# EAGLE design aquaMain (EAGLE 6.6.0)
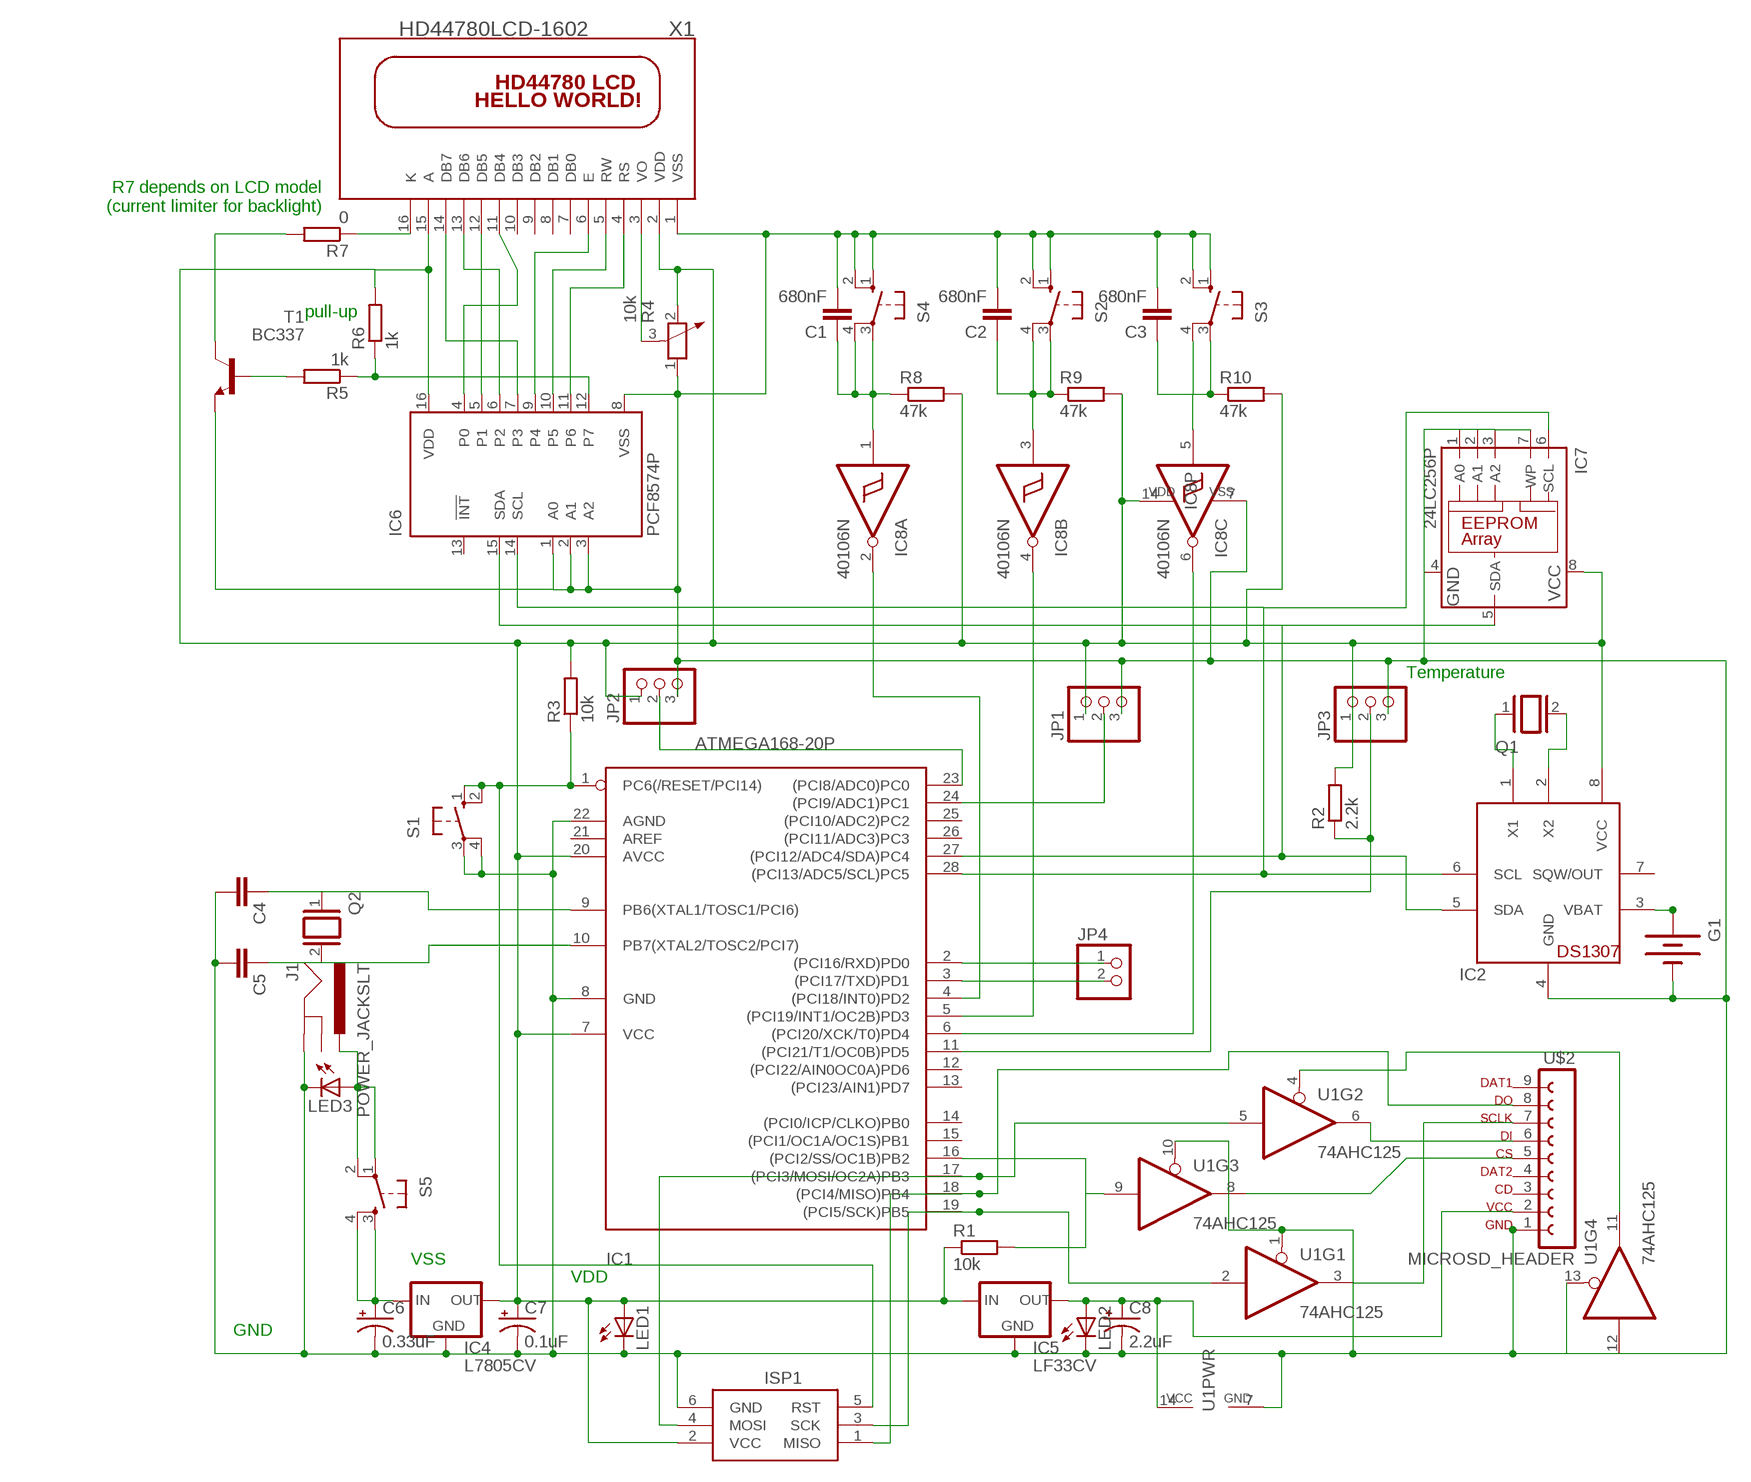
[diagram p0: schematic, sheet 1]

## Parts
C1  680nF  C-EU050-050X075  [C050-050X075]
C2  680nF  C-EU050-050X075  [C050-050X075]
C3  680nF  C-EU050-050X075  [C050-050X075]
C4  C-EU025-024X044  [C025-024X044]
C5  C-EU025-024X044  [C025-024X044]
C6  0.33uF  CPOL-USE5-6  [E5-6]
C7  0.1uF  CPOL-USE5-6  [E5-6]
C8  2.2uF  CPOL-USE5-6  [E5-6]
G1  BATTERY20PTH  [BATTCOM_20MM_PTH]
IC1  ATMEGA168-20P  [DIL28-3]
IC2  DS1307  [DIL08]
IC4  L7805CV  [TO220]
IC5  LF33CV  [TO220]
IC6  PCF8574P  [DIL16]
IC7  24LC256P  [DIL8]
IC8  40106N  [DIL14]
ISP1  AVRISP-6  [AVRISP]
J1  POWER_JACKSLT  [POWER_JACK_SLOT]
JP1  PINHD-1X3  [1X03]
JP2  PINHD-1X3  [1X03]
JP3  PINHD-1X3  [1X03]
JP4  PINHD-1X2  [1X02]
LED1  LED3MM  [LED3MM]
LED2  LED3MM  [LED3MM]
LED3  LED3MM  [LED3MM]
Q1  XTAL/S  [QS]
Q2  XTAL/S  [QS]
R1  10k  R-EU_0204/7  [0204/7]
R2  2.2k  R-EU_0204/7  [0204/7]
R3  10k  R-EU_0204/7  [0204/7]
R4  10k  POTENTIOMETER_PT-10  [PT-10]
R5  1k  R-EU_0204/5  [0204/5]
R6  1k  R-EU_0204/5  [0204/5]
R7  0  R-EU_0204/5  [0204/5]
R8  47k  R-EU_0204/5  [0204/5]
R9  47k  R-EU_0204/5  [0204/5]
R10  47k  R-EU_0204/5  [0204/5]
S1  40-XX-ROUND  [B3F-40XX-ROUND]
S2  40-XX-ROUND  [B3F-40XX-ROUND]
S3  40-XX-ROUND  [B3F-40XX-ROUND]
S4  40-XX-ROUND  [B3F-40XX-ROUND]
S5  TAC_SWITCHPTH  [TACTILE-PTH]
T1  BC337  [TO92]
U1  74AHC125  [DIP14]
U$2  MICROSD_HEADER  [9PINH]
X1  HD44780LCD-1602  [LCD1602]

## Nets
N$2: IC1.23((PCI8/ADC0)PC0) JP2.2
N$3: IC1.5((PCI19/INT1/OC2B)PD3) IC8.4(B:O)
N$4: IC2.1(X1) Q1.1
N$5: IC2.2(X2) Q1.2
N$6: G1.1(+) IC2.3(VBAT)
N$7: IC1.11((PCI21/T1/OC0B)PD5) JP3.2 R2.1
N$8: IC1.28((PCI13/ADC5/SCL)PC5) IC2.6(SCL) IC6.14(SCL) IC7.6(SCL)
N$9: IC1.4((PCI18/INT0)PD2) IC8.2(A:O)
N$10: IC1.6((PCI20/XCK/T0)PD4) IC8.6(C:O)
N$11: C4.1 IC1.9(PB6(XTAL1/TOSC1/PCI6)) Q2.1
N$12: C5.1 IC1.10(PB7(XTAL2/TOSC2/PCI7)) Q2.2
N$13: IC1.18((PCI4/MISO)PB4) ISP1.1(MISO) U$2.8
N$14: IC1.17((PCI3/MOSI/OC2A)PB3) ISP1.4(MOSI) U1.5(I)
N$15: IC1.16((PCI2/SS/OC1B)PB2) R1.2 U1.9(I)
N$16: IC1.19((PCI5/SCK)PB5) ISP1.3(SCK) U1.2(I)
N$17: U1.3(O) U$2.7
N$18: U1.8(O) U$2.5
N$19: U1.6(O) U$2.6
N$20: IC1.1(PC6(/RESET/PCI14)) ISP1.5(RST) R3.1 S1.1(S) S1.2(S1)
N$21: IC1.27((PCI12/ADC4/SDA)PC4) IC2.5(SDA) IC6.15(SDA) IC7.5(SDA)
N$22: C8.+ IC5.VOUT(OUT) LED2.A U1.14(PWR:VCC) U$2.2
N$23: R4.3 X1.3(VO)
N$24: IC1.24((PCI9/ADC1)PC1) JP1.2
N$25: C7.+ IC1.7(VCC) IC1.20(AVCC) IC2.8(VCC) IC4.VOUT(OUT) IC5.VIN(IN) IC6.16(VDD) IC7.8(VCC) IC8.14(P:VDD) ISP1.2(VCC) JP1.1 JP2.1 JP3.1 LED1.A R1.1 R2.2 R3.2 R4.2 R6.2 R8.2 R9.2 R10.2 X1.2(VDD) X1.15(A)
N$31: J1.PWR LED3.A S5.1 S5.2
N$32: IC6.4(P0) X1.11(DB4)
N$33: IC6.5(P1) X1.12(DB5)
N$34: IC6.6(P2) X1.13(DB6)
N$35: IC6.7(P3) X1.14(DB7)
N$36: IC6.9(P4) X1.6(E)
N$37: IC6.10(P5) X1.5(RW)
N$38: IC6.11(P6) X1.4(RS)
N$39: IC6.12(P7) R5.1 R6.1
N$40: R5.2 T1.2(B)
N$41: R7.1 X1.16(K)
N$42: R7.2 T1.3(C)
N$43: C1.1 IC8.1(A:I) R8.1 S4.3(P) S4.4(P1)
N$44: C2.1 IC8.3(B:I) R9.1 S2.3(P) S2.4(P1)
N$45: C3.1 IC8.5(C:I) R10.1 S3.3(P) S3.4(P1)
N$46: C6.+ IC4.VIN(IN) S5.3 S5.4
N$56: IC1.2((PCI16/RXD)PD0) JP4.1
N$57: IC1.3((PCI17/TXD)PD1) JP4.2
N$58: U1.4(OE) U1.11(O)
VSS: C1.2 C2.2 C3.2 C4.2 C5.2 C6.- C7.- C8.- G1.2(-) IC1.8(GND) IC1.22(AGND) IC2.4(GND) IC4.GND IC5.GND IC6.1(A0) IC6.2(A1) IC6.3(A2) IC6.8(VSS) IC7.1(A0) IC7.2(A1) IC7.3(A2) IC7.4(GND) IC7.7(WP) IC8.7(P:VSS) ISP1.6(GND) J1.GND@2(GND) JP1.3 JP2.3 JP3.3 LED1.K(C) LED2.K(C) LED3.K(C) R4.1 S1.3(P) S1.4(P1) S2.1(S) S2.2(S1) S3.1(S) S3.2(S1) S4.1(S) S4.2(S1) T1.1(E) U1.1(OE) U1.7(PWR:GND) U1.10(OE) U1.12(I) U1.13(OE) U$2.1 X1.1(VSS)
Unconnected: IC1.12((PCI22/AIN0OC0A)PD6) IC1.13((PCI23/AIN1)PD7) IC1.14((PCI0/ICP/CLKO)PB0) IC1.15((PCI1/OC1A/OC1S)PB1) IC1.21(AREF) IC1.25((PCI10/ADC2)PC2) IC1.26((PCI11/ADC3)PC3) IC2.7(SQW/OUT) IC6.13(!INT) IC8.8(D:O) IC8.9(D:I) IC8.10(E:O) IC8.11(E:I) IC8.12(F:O) IC8.13(F:I) J1.GND@1(GNDBREAK) U$2.3 U$2.4 U$2.9 X1.7(DB0) X1.8(DB1) X1.9(DB2) X1.10(DB3)

## Notes on the sheet
- R7 depends on LCD model
  (current limiter for backlight)
- pull-up
- Temperature
- VSS
- VDD
- GND

## Library data of the parts
C1-C5 = rcl:C-EU: CAPACITOR, European symbol
C6-C8 = rcl:CPOL-US: POLARIZED CAPACITOR, American symbol
G1 = SparkFun-Electromechanical:BATTERY: Battery Holders Various common sizes : AA, AAA, 20mm coin cell and 12mm coin cell. 20MM_4LEGS, BATT-10373
IC1 = adafruit:ATMEGA168*P: MICROCONTROLLER 16 kBytes FLASH 1 kBytes SRAM 512 Bytes EEPROM USART 8-channel 10 bit ADC
IC2 = adafruit:DS1307: DS1307 Real time clock (RTC) with battery backup ability. Talk to it via i2c
IC4 = dedicatedLib:L7805CV: L7805CV Positive voltage regulator 5V 0.5A From http://datasheet.octopart.com/L7805CV-STMicroelectronics-datasheet-7264666.pdf
IC5 = dedicatedLib:LF33CV: LF33CV Low-drop voltage regulator 3.3V 0.5A From http://www.farnell.com/datasheets/1599547.pdf
IC6 = micro-philips:PCF8574: I2C-Bus Remote 8-bit I/O expander http://www.semiconductors.philips.com/acrobat_download/datasheets/PCF8574_4.pdf; MPN: PCF8574PN; OC_FARNELL: 204020; OC_NEWARK: 11N8515
IC7 = microchip:24*: Serial EEPROM I2C; MF: MICROCHIP; MPN: 24LC256-E/P; OC_FARNELL: 9757970; OC_NEWARK: 92C7169
IC8 = 40xx:40106: Hex SCHMITT TRIGGER
ISP1 = adafruit:AVRISP: AVR ISP HEADER Standard 6 pin header for AVR programming
J1 = SparkFun-Connectors:POWER_JACK: Power Jack This is the standard 5.5mm barrel jack for power. The PTH is the most common, proven, reliable, footprint. The Slot footprint only works if the mill layer is transmitted to the PCB fab house so be warned. Mating wall wart : TOL-00298 (and others); PROD_ID: PRT-00119
JP1-JP3 = adafruit:PINHD-1X3: PIN HEADER
JP4 = pinhead:PINHD-1X2: PIN HEADER
LED1-LED3 = SparkFun-LED:LED: LEDs Standard schematic elements and footprints for 5mm, 3mm, 1206, and 0603 sized LEDs. 5mm - Spark Fun Electronics SKU : COM-00529 (and others)
Q1 Q2 = special:XTAL/S: CRYSTAL
R1-R3 R5-R10 = rcl:R-EU_: RESISTOR, European symbol
R4 = rcl:POTENTIOMETER_: Potentiometer
S1-S4 = adafruit:40-XX: OMRON SWITCH
S5 = SparkFun-Electromechanical:TAC_SWITCH: Momentary Switch Button commonly used for reset or general input. Spark Fun Electronics SKU : COM-00097 SMT- SWCH-08247
T1 = transistor:BC337: NPN TRANSISTOR
U1 = dedicatedLib:74AHC125: The 74AHC125 74AHCT125 provides four non-inverting buffer/line drivers with 3-state outputs. The 3-state outputs (nY) are controlled by the output enable input (nOE). A HIGH at nOE causes the outputs to assume a high-impedance OFF-state.
U$2 = dedicatedLib:MICROSD_HEADER
X1 = adafruit:HD44780LCD: HD44780 LCD Standard character type LCDs, available in sizes from 8x1 to 40x4!

## Board
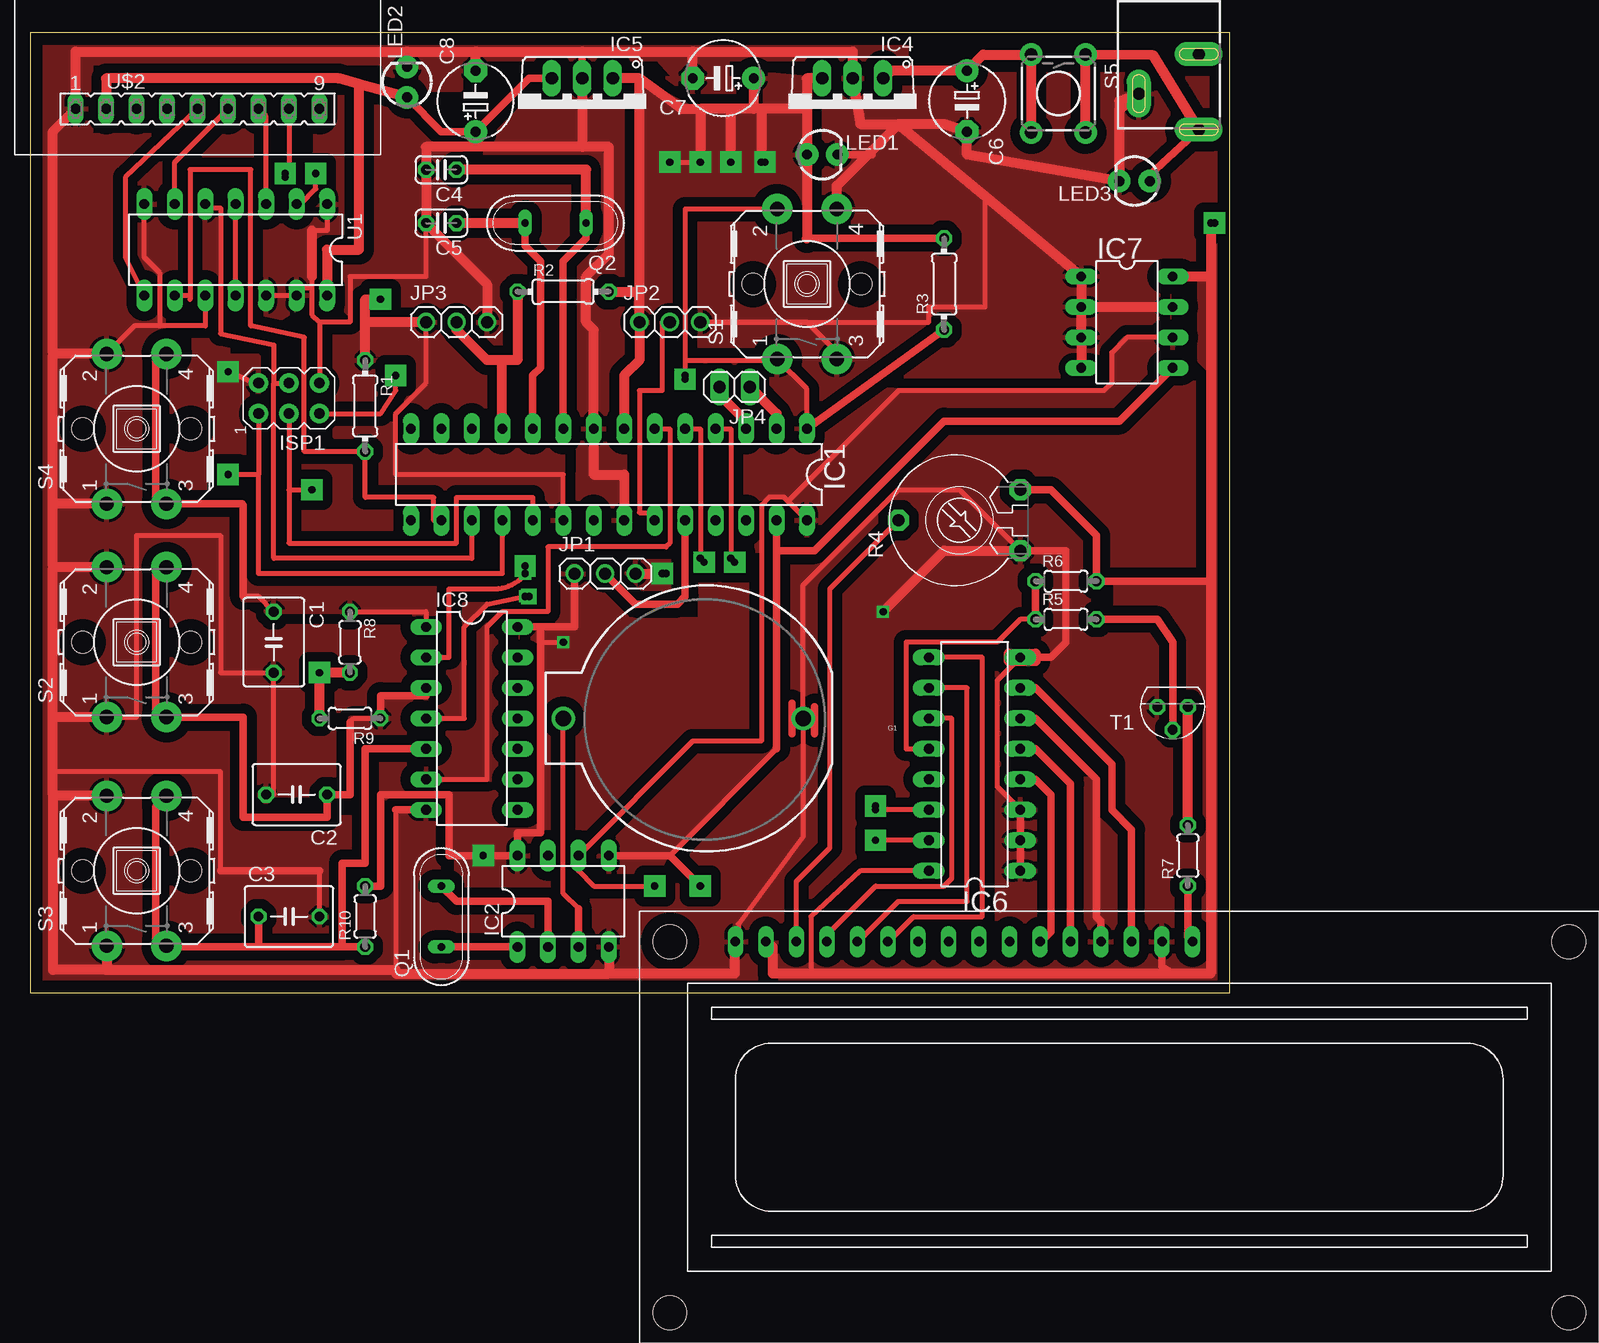
[diagram p1: board, top side]
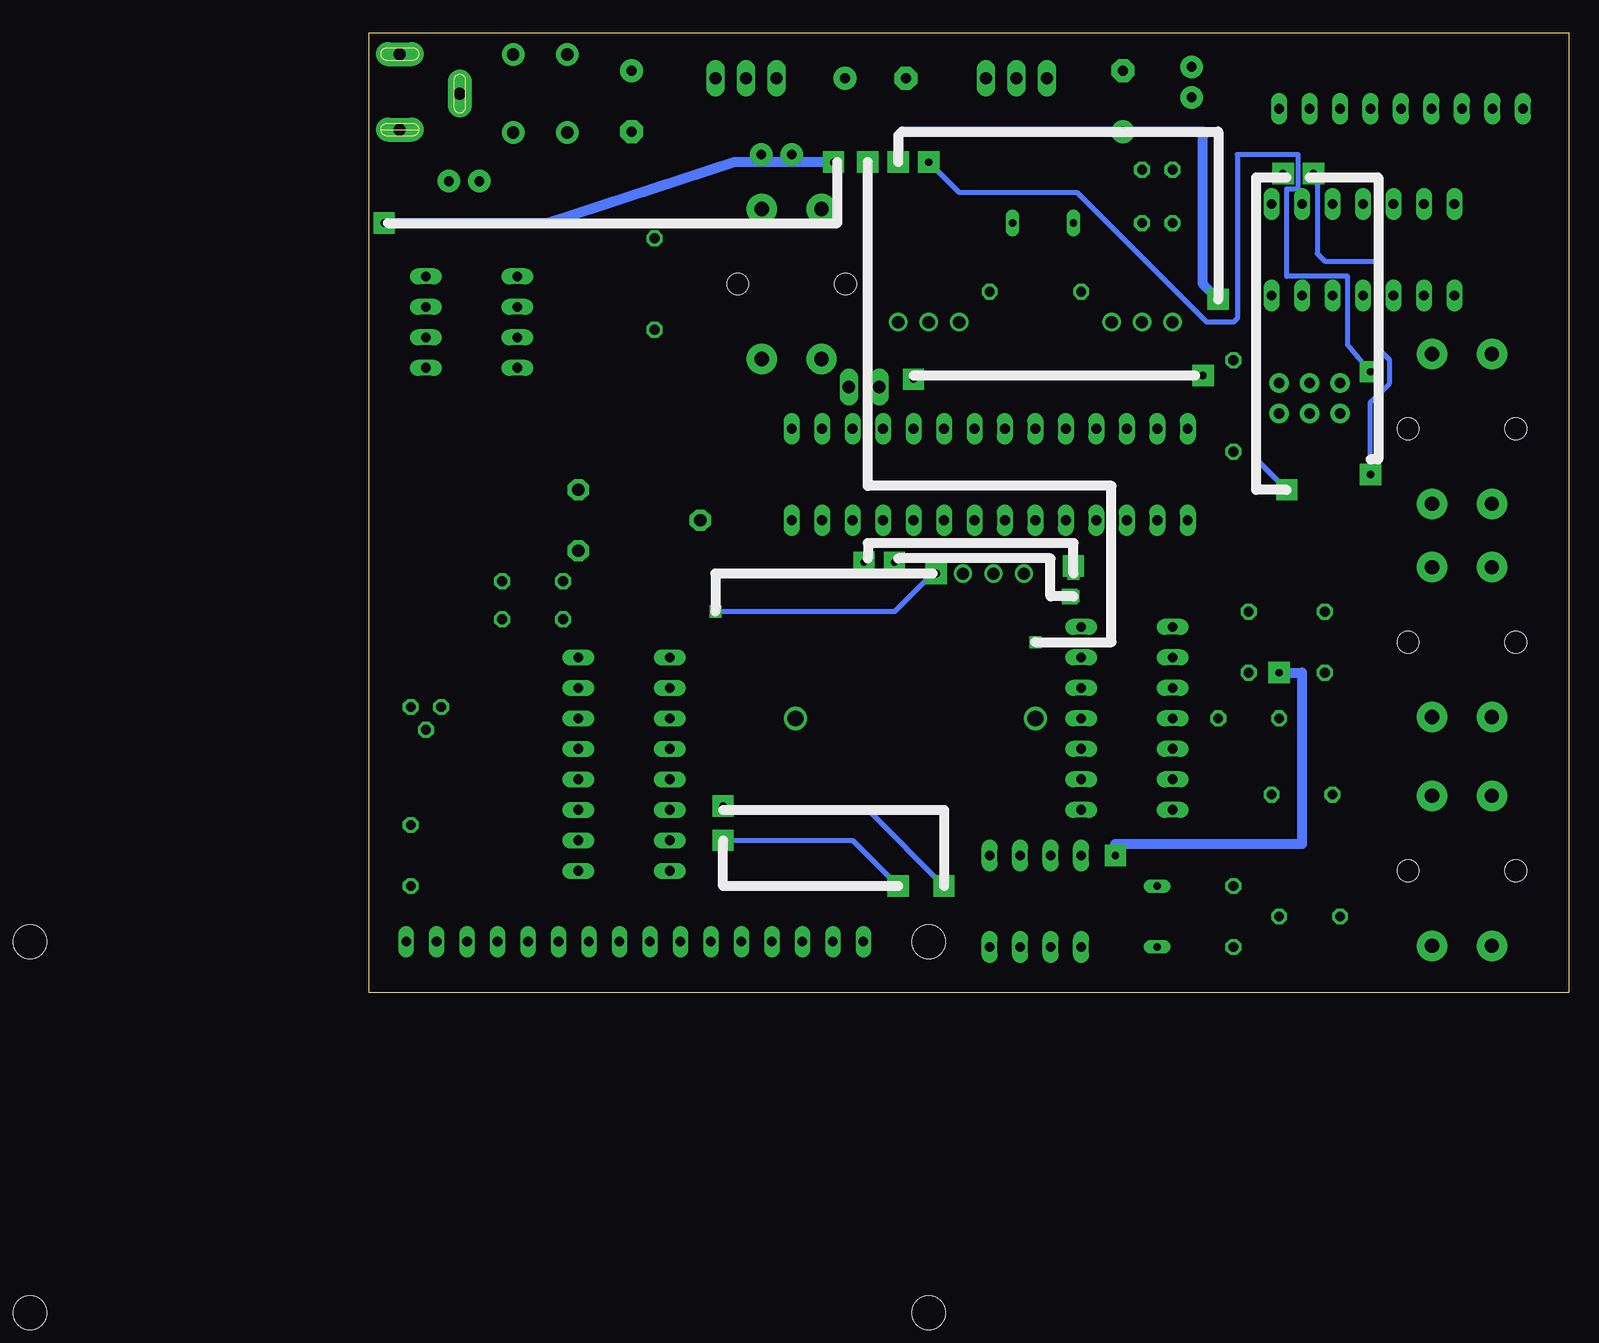
[diagram p2: board, bottom side, seen from below]

Size 100 x 80 mm. Coordinates in mm from the lower left corner, seen from the top.
Outline: 0,0 100,0 100,80 0,80 0,0
Copper layers (1*16): Top 0.035mm / dielectric 1.5mm / Bottom 0.035mm
Design rules "default": minimum track width 10mil, minimum drill 24mil, track to track 8mil, track to pad 8mil, pad to pad 8mil, via to via 8mil, smd to smd 8mil, copper to edge 40mil, drill to drill 8mil, minimum pad ring 10mil, minimum via ring 8mil, stop-mask expansion 4mil, vias tented up to drill 0mil, thermal gap 10mil

### Footprints (pad centres in the part's own frame; a part is rotated, then mirrored left to right if it is on the bottom)
C050-050X075 = drill 0.813 octagon: 1 -2.54,0; 2 2.54,0
C025-024X044 = drill 0.813 octagon: 1 -1.27,0; 2 1.27,0
E5-6 = drill 0.813 pad 1.905: + -2.54,0 | drill 0.813 pad 1.905 octagon: - 2.54,0
BATTCOM_20MM_PTH = drill 1.3: 1 11.85,0; 2 -8.15,0
DIL28-3 = drill 0.813 long: 1 -16.51,-3.81; 2 -13.97,-3.81; 3 -11.43,-3.81; 4 -8.89,-3.81; 5 -6.35,-3.81; 6 -3.81,-3.81; 7 -1.27,-3.81; 8 1.27,-3.81; 9 3.81,-3.81; 10 6.35,-3.81; 11 8.89,-3.81; 12 11.43,-3.81; 13 13.97,-3.81; 14 16.51,-3.81; 15 16.51,3.81; 16 13.97,3.81; 17 11.43,3.81; 18 8.89,3.81; 19 6.35,3.81; 20 3.81,3.81; 21 1.27,3.81; 22 -1.27,3.81; 23 -3.81,3.81; 24 -6.35,3.81; 25 -8.89,3.81; 26 -11.43,3.81; 27 -13.97,3.81; 28 -16.51,3.81
DIL08 = drill 0.813 long: 1 -3.81,-3.81; 2 -1.27,-3.81; 3 1.27,-3.81; 4 3.81,-3.81; 5 3.81,3.81; 6 1.27,3.81; 7 -1.27,3.81; 8 -3.81,3.81
TO220 = drill 1.016 long: GND 0,0; VIN -2.54,0; VOUT 2.54,0
DIL16 = drill 0.813 long: 1 -8.89,-3.81; 2 -6.35,-3.81; 3 -3.81,-3.81; 4 -1.27,-3.81; 5 1.27,-3.81; 6 3.81,-3.81; 7 6.35,-3.81; 8 8.89,-3.81; 9 8.89,3.81; 10 6.35,3.81; 11 3.81,3.81; 12 1.27,3.81; 13 -1.27,3.81; 14 -3.81,3.81; 15 -6.35,3.81; 16 -8.89,3.81
DIL8 = drill 0.813 long: 1 -3.81,-3.81; 2 -1.27,-3.81; 3 1.27,-3.81; 4 3.81,-3.81; 5 3.81,3.81; 6 1.27,3.81; 7 -1.27,3.81; 8 -3.81,3.81
DIL14 = drill 0.813 long: 1 -7.62,-3.81; 2 -5.08,-3.81; 3 -2.54,-3.81; 4 0,-3.81; 5 2.54,-3.81; 6 5.08,-3.81; 7 7.62,-3.81; 8 7.62,3.81; 9 5.08,3.81; 10 2.54,3.81; 11 0,3.81; 12 -2.54,3.81; 13 -5.08,3.81; 14 -7.62,3.81
AVRISP = drill 0.9 pad 1.626: 1 -1.27,2.54; 2 1.27,2.54; 3 -1.27,0; 4 1.27,0; 5 -1.27,-2.54; 6 1.27,-2.54
POWER_JACK_SLOT = drill 1 pad 2 long: GND@1 2.58,7.5; GND@2 7.58,10.8; PWR 2.58,13.8
1X03 = drill 1.016: 1 -2.54,0; 2 0,0; 3 2.54,0
1X02 = drill 1.016 long: 1 -1.27,0; 2 1.27,0
LED3MM = drill 0.813 pad 1.88: A -1.27,0; K 1.27,0
QS = drill 0.61 long: 1 -2.54,0; 2 2.54,0
0204/7 = drill 0.813 octagon: 1 -3.81,0; 2 3.81,0
PT-10 = drill 1.016 pad 1.778 octagon: 1 -2.54,-5.08; 2 2.54,-5.08; 3 0,5.08
0204/5 = drill 0.813 octagon: 1 -2.54,0; 2 2.54,0
B3F-40XX-ROUND = drill 1.194 pad 2.54: 1 -6.248,2.489; 2 6.248,2.489; 3 -6.248,-2.489; 4 6.248,-2.489 | hole 1.803: 0,-4.496; 0,4.496
TACTILE-PTH = drill 1.016 pad 1.88: 1 -3.251,2.261; 2 3.251,2.261; 3 -3.251,-2.261; 4 3.251,-2.261
TO92 = drill 0.813 octagon: 1 1.27,0; 2 0,1.905; 3 -1.27,0
DIP14 = drill 0.813 long: 1 -7.62,-3.81; 2 -5.08,-3.81; 3 -2.54,-3.81; 4 0,-3.81; 5 2.54,-3.81; 6 5.08,-3.81; 7 7.62,-3.81; 8 7.62,3.81; 9 5.08,3.81; 10 2.54,3.81; 11 0,3.81; 12 -2.54,3.81; 13 -5.08,3.81; 14 -7.62,3.81
9PINH = drill 0.813 long: 1 -10.16,0; 2 -7.62,0; 3 -5.08,0; 4 -2.54,0; 5 0,0; 6 2.54,0; 7 5.08,0; 8 7.62,0; 9 10.16,0
LCD1602 = drill 0.8 long: 1 8,33.46; 2 10.54,33.46; 3 13.08,33.46; 4 15.62,33.46; 5 18.16,33.46; 6 20.7,33.46; 7 23.24,33.46; 8 25.78,33.46; 9 28.32,33.46; 10 30.86,33.46; 11 33.4,33.46; 12 35.94,33.46; 13 38.48,33.46; 14 41.02,33.46; 15 43.56,33.46; 16 46.1,33.46 | hole 2.8: 2.54,2.54; 2.54,33.46; 77.46,33.46; 77.46,2.54

### Placement (x,y rotation side)
C1  20.32,29.21 270 top
C2  22.23,16.51 180 top
C3  21.59,6.35 0 top
C4  34.29,68.58 180 top
C5  34.29,64.14 180 top
C6  78.11,74.3 270 top
C7  57.78,76.2 180 top
C8  37.15,74.3 90 top
G1  56.3,22.86 180 top
IC1  48.26,43.18 180 top
IC2  44.45,7.62 0 top
IC4  68.58,76.2 180 top
IC5  46.04,76.2 180 top
IC6  78.74,19.05 90 top
IC7  91.44,55.88 270 top
IC8  36.83,22.86 270 top
ISP1  21.59,49.53 90 top
J1  100.01,85.72 180 top
JP1  47.94,34.92 0 top
JP2  53.34,55.88 0 top
JP3  35.56,55.88 0 top
JP4  58.74,50.48 180 top
LED1  66.04,69.85 0 top
LED2  31.43,75.88 90 top
LED3  92.08,67.63 180 top
Q1  34.29,6.35 90 top
Q2  43.81,64.14 180 top
R1  27.94,48.9 270 top
R2  44.45,58.42 0 top
R3  76.2,59.05 90 top
R4  77.47,39.37 90 top
R5  86.36,31.11 0 top
R6  86.36,34.29 0 top
R7  96.52,11.43 90 top
R8  26.67,29.21 270 top
R9  26.67,22.86 180 top
R10  27.94,6.35 90 top
S1  64.77,59.05 90 top
S2  8.89,29.21 90 top
S3  8.89,10.16 90 top
S4  8.89,46.99 90 top
S5  85.72,74.93 270 top
T1  95.25,23.81 180 top
U1  17.14,61.91 180 top
U$2  13.97,73.66 0 top
X1  50.8,-29.21 0 top

### Tracks (layer width: path | path; a pad name or v marks a point on that pad's centre or on a via)
N$1
  pour Top (isolate 0.813): 92.08,78.11 97.79,78.11 98.11,77.79 98.11,71.44 96.2,71.44 96.2,73.66
N$2
  Top 0.406: JP2.2 52.7,55.88 52.7,50.16 50.8,50.16 50.8,40.01 52.07,40.01 IC1.23
N$3  (via drill 0.6, 0.6 pad 1.27)
  Top 0.406: IC8.4 36.2,22.86 36.2,30.48 38.1,32.38 v41.27,33.02 | IC1.5 55.88,46.99 v55.88,36.2
  Bottom 0.406: v55.88,36.2 43.18,36.2 43.18,33.02 v41.59,33.02 v41.27,33.02
  pour Top (isolate 0.813): 35.88,22.86 33.97,22.86 33.97,27.62 36.2,27.62
  pour Top (isolate 0.813): 38.1,32.38 36.2,30.48 36.2,32.38 37.78,32.38
N$4
  Top 0.61: IC2.1 Q1.1
N$5
  Top 0.61: IC2.2 43.18,7.62 35.56,7.62 Q1.2
N$6
  Top 0.406: 45.72,6.99 44.45,8.26 G1.1
  Top 0.61: IC2.3 45.72,6.99
N$7
  Top 0.813: R2.1 40.64,52.7 39.37,52.7 | 39.37,52.7 38.1,52.7 35.56,55.24 JP3.2 | IC1.11 39.37,52.7
N$8  (via drill 0.6, 0.6 pad 1.78)
  Top 0.406: v52.07,8.89 46.99,8.89 45.72,10.16 IC2.6 55.24,20.95 60.96,20.95 60.96,40.64 61.59,41.27 62.87,41.27 63.18,40.96 | IC6.14 v70.48,15.24 | IC1.28 63.18,40.96 | IC7.6 91.44,54.61 90.17,53.34 90.17,50.8 89.53,50.16 72.39,50.16 63.18,40.96
  Bottom 0.406: v70.48,15.24 58.42,15.24 v52.07,8.89
  pour Top (isolate 0.813): 95.25,54.61 95.25,51.75 90.81,47.62 76.2,47.62 65.09,36.83 62.23,36.83 58.42,36.83 58.42,46.99 64.77,46.99 69.85,50.48 72.71,50.16 89.53,50.16 90.17,50.8 90.17,53.34 91.44,54.61
N$9  (via drill 0.6, 0.6 pad 1.78)
  Top 0.406: IC8.2 34.92,27.94 34.92,33.66 38.73,33.66 arc53 v41.27,34.92 | IC1.4 58.42,46.99 v58.42,36.2
  Bottom 0.406: v58.42,36.2 58.42,37.47 41.27,37.47 v41.27,35.56 v41.27,34.92
N$10
  Top 0.406: IC8.6 38.1,17.78 38.1,30.48 39.37,31.75 43.18,31.75 43.18,37.15 53.02,37.15 53.34,37.47 53.34,46.99 IC1.6
  pour Top (isolate 0.813): 38.1,29.21 38.1,30.8 36.51,30.8 36.2,30.48 36.2,23.18 35.88,22.86 33.02,22.86 33.02,17.78 32.7,17.46 36.83,18.1 38.1,17.78 39.69,17.78 39.69,31.43
N$11
  Top 0.61: Q2.1 46.35,62.87 44.45,60.96 IC1.9
  Top 0.813: Q2.1 46.35,68.58 C4.1
N$12
  Top 0.61: Q2.2 41.27,62.23 42.55,60.96 42.55,52.07 41.91,51.44 IC1.10
  Top 0.813: Q2.2 C5.1
N$13  (via drill 0.6, 0.6 pad 1.78)
  Top 0.406: IC1.18 39.37,34.92 19.05,34.92 19.05,43.18 | v21.27,67.94 v21.27,68.26 21.59,68.26 U$2.8 | ISP1.1 19.05,43.18 | 19.05,43.18 v16.51,43.18
  Bottom 0.406: v16.51,43.18 16.51,49.21 14.92,50.8 14.92,52.7 15.88,53.66 15.88,60.96 20.32,60.96 20.95,61.59 20.95,67.31 v21.27,67.94
N$14
  Top 0.406: IC1.17 36.83,36.2 20.32,36.2 20.32,50.8 | 20.32,50.8 ISP1.4 | 20.32,50.8 20.32,53.98 15.88,54.93 15.88,65.41 14.61,65.41 U1.5
  pour Top (isolate 0.813): 14.61,65.41 18.41,65.41 18.41,57.47 13.34,57.47 13.34,65.41
N$15
  Top 0.406: IC1.16 33.66,39.37 33.66,41.27 27.94,41.27 R1.2 22.86,45.09 22.86,54.61 18.41,55.56 18.41,68.58 13.34,68.58 13.34,58.1 | 13.34,58.1 13.34,57.78 | U1.9 13.34,58.1
N$16  (via drill 0.6, 0.6 pad 1.78)
  Top 0.406: 21.59,41.91 21.59,37.47 35.56,37.47 35.56,41.27 41.91,41.27 IC1.19 | v23.81,68.26 23.81,66.99 22.54,65.72 U1.2 | ISP1.3 21.59,41.91 | 21.59,41.91 v23.5,41.91
  Bottom 0.406: v23.5,41.91 26.04,44.45 26.04,67.94 v23.81,68.26
N$17
  Top 0.406: U$2.7 19.68,73.03 U1.3
N$18
  Top 0.406: U$2.5 7.94,67.94 7.94,61.28 U1.8
  pour Top (isolate 0.813): 13.34,67.31 19.68,67.31 19.68,73.03 16.51,73.03 16.51,71.75 13.34,68.58
N$19
  Top 0.406: U1.6 12.06,69.22 U$2.6
N$20  (via drill 0.6, 0.6 pad 1.78)
  Top 0.406: IC1.1 64.77,50.32 S1.1 62.28,52.7 54.61,52.7 | S1.2 54.61,65.3 54.61,52.7 | 54.61,52.7 v54.61,51.44 | ISP1.5 29.21,48.26 30.48,50.16 v30.48,51.44
  Top 0.61: R3.1 IC1.1
  Bottom 0.406: v30.48,51.44 v54.61,51.44
  pour Top (isolate 0.813): 64.77,46.99 53.34,46.99 53.34,52.7 62.23,52.7 64.45,50.16
N$21  (via drill 0.6, 0.6 pad 1.78)
  Top 0.406: 62.23,20.32 53.34,11.43 | IC6.15 v70.48,12.7 | IC1.27 62.23,36.83
  Top 0.61: IC2.5 53.34,11.43 v55.88,8.89 | IC1.27 62.23,20.32 | 62.23,36.83 65.41,36.83 76.2,47.62 90.81,47.62 IC7.5
  Bottom 0.406: v70.48,12.7 59.69,12.7 v55.88,8.89
  pour Top (isolate 0.813): 62.23,20.32 60.64,20.95 55.24,20.95 45.72,11.43 45.72,9.84 46.99,8.89 51.75,8.89 53.02,11.43 61.59,19.68
N$22
  Top 0.61: IC5.VOUT 41.59,76.2 C8.+ 34.29,71.75 LED2.A
  Top 0.813: LED2.A 27.44,75.72 | 27.44,75.72 25.72,76.2 6.35,76.2 U$2.2 | 27.44,75.72 27.44,61.91 24.77,61.91 U1.14
N$23
  Top 0.406: X1.3 63.88,9.27 66.67,12.06 66.67,33.66 R4.3
N$24
  Top 0.61: JP1.2 50.48,32.38 53.98,32.38 54.61,33.02 IC1.24
N$25  (via drill 0.6, 0.6 pad 1.78)
  Top 0.406: IC6.16 69.22,10.16 65.09,6.35 65.09,1.59 | IC1.20 44.45,43.18 30.48,43.18 30.48,48.26 33.02,50.8 JP3.1 | 42.55,29.21 v44.45,29.21 | ISP1.2 18.73,50.8 v16.51,51.75 | v53.34,69.22 v55.88,69.22
  Top 0.61: 98.42,1.59 98.42,34.29 R6.2 88.9,38.1 85.09,41.91 R4.2 | X1.15 94.36,2.16 95.25,1.59 | R3.2 64.77,62.87 | R10.2 29.21,8.89 29.21,16.51 34.92,16.51 34.92,11.43 v37.78,11.43 IC2.8 40.64,13.34 42.55,13.34 42.55,29.21 42.55,30.48 | 42.55,30.48 IC8.14 | JP1.1 45.4,30.48 42.55,30.48
  Top 0.813: 60.96,73.66 60.33,73.66 | 60.33,73.66 58.42,73.66 | 58.42,73.66 55.88,73.66 | 50.8,76.2 54.29,73.66 55.88,73.66 | 50.8,76.2 IC5.VIN | 50.8,58.42 JP2.1 50.8,52.7 49.53,51.44 IC1.7 | 50.8,58.42 50.8,76.2 | R2.2 50.8,58.42 | IC7.8 98.42,59.69 | 98.42,59.69 98.42,1.59 95.25,1.59 65.09,1.59 61.91,1.59 61.91,3.81 61.34,3.81 X1.2 | v98.42,64.14 98.42,59.69 | 60.96,73.66 v60.96,69.22 | 55.88,73.66 v55.88,69.22 | R1.1 27.94,55.88 | 27.94,55.88 27.94,57.78 v29.21,57.78 | JP3.1 27.94,55.88 | v58.42,69.22 58.42,73.66 | 64.77,73.66 LED1.A 64.77,62.87 | IC4.VOUT 64.77,76.2 64.77,73.66 | 64.77,73.66 60.96,73.66 | C7.+ 60.33,73.66 | R8.2 v24.13,26.67 R9.2
  Bottom 0.406: v44.45,29.21 38.1,29.21 38.1,42.23 58.42,42.23 v58.42,69.22 | v16.51,51.75 18.41,53.98 18.41,59.69 23.5,59.69 23.5,66.99 22.54,66.99 22.54,69.85 27.62,69.85 27.62,56.2 27.94,55.88 30.16,55.88 40.96,66.67 50.8,66.67 v53.34,69.22
  Bottom 0.813: v60.96,69.22 v61.28,69.22 69.53,69.22 85.09,64.14 v98.42,64.14 | v29.21,57.78 30.48,59.05 30.48,71.75 55.56,71.75 55.88,71.44 v55.88,69.22 | v24.13,26.67 22.23,26.67 22.23,12.38 37.78,12.38 v37.78,11.43
  pour Top (isolate 0.813): 100.33,32.7 100.33,63.82 100.01,64.14 98.11,64.14 98.42,63.82 98.42,59.69 97.47,59.37 97.47,52.7 98.42,51.75 98.42,33.97 90.49,33.97 90.49,30.16 95.25,25.4 95.25,19.68 93.03,17.46 86.68,17.46 85.09,15.88 85.09,5.08 84.14,4.13 61.91,4.13 61.91,1.91 62.55,1.27 62.55,0.64 99.69,0.64 100.01,0.95 100.01,32.38
  pour Top (isolate 0.813): 51.12,75.88 55.88,73.34 64.77,73.34 64.77,65.41 54.61,65.41 54.61,55.56 50.48,55.88 51.12,73.66
  pour Top (isolate 0.813): 64.77,76.2 61.28,76.52 61.28,72.39 64.45,72.39
  pour Top (isolate 0.813): 44.45,39.37 44.45,46.99 30.48,46.99 30.48,48.26 33.02,50.8 33.02,55.56 27.94,55.56 27.94,57.78 25.4,57.78 25.4,46.35 29.21,46.35 29.21,41.27 33.66,41.27 33.66,39.37
  pour Top (isolate 0.813): 33.02,55.88 35.56,55.88 38.42,52.7 39.37,52.7 39.37,46.99 29.84,46.99 29.84,55.88
  pour Top (isolate 0.813): 44.45,35.56 46.04,35.56 49.85,31.11 55.88,31.11 55.88,39.05 60.96,39.05 60.96,20.95 55.24,20.95 45.4,11.11 44.45,11.11 44.45,7.62 35.56,7.62 35.56,11.43 34.92,12.06 34.92,16.19 27.94,16.19 27.94,20.64 40.96,20.32 40.96,30.16 43.81,30.48 44.13,31.11 44.13,32.38
  pour Top (isolate 0.813): 19.05,50.8 19.05,53.02 16.51,53.02 16.51,55.56 14.92,57.15 13.65,56.83 13.65,53.34 10.79,53.34 10.48,53.02 10.48,40.96 21.59,40.96 21.59,50.8
N$26
  Top 0.813: 87,52.07 88.27,52.07
N$29
  Top 0.813: 83.82,28.26 83.82,27.62 81.6,27.62 81.6,28.26 83.82,28.26
N$31
  Top 0.61: LED3.A 93.34,68.16 J1.PWR
  Top 0.813: J1.PWR 93.66,78.11 S5.1 S5.2
N$32
  Top 0.61: X1.11 84.26,4.25 85.09,5.08 85.09,16.51 83.82,17.78 IC6.4
N$33
  Top 0.61: X1.12 86.74,17.4 83.82,20.32 IC6.5
N$34
  Top 0.61: X1.13 89.28,5.97 88.9,6.35 88.9,17.78 83.82,22.86 IC6.6
  pour Top (isolate 0.813): 86.68,4.13 91.44,4.13 91.76,3.81 91.76,13.65 90.17,15.24 88.9,15.24 88.9,17.78 87,17.78 86.68,17.46
N$35
  Top 0.61: X1.14 91.82,13.59 90.17,15.24 90.17,19.05 83.82,25.4 IC6.7
N$36
  Top 0.406: X1.6 71.56,4.25 73.66,6.35 79.38,6.35 79.38,27.94 IC6.9
N$37
  Top 0.406: X1.5 69.02,4.25 72.39,7.62 78.11,7.62 78.11,25.4 IC6.10
N$38
  Top 0.406: X1.4 66.42,4.83 70.48,8.89 76.2,8.89 76.83,9.53 76.83,22.86 IC6.11
N$39
  Top 0.406: R5.1 82.55,31.11 80.64,29.21 73.03,29.21 73.03,20.32 IC6.12
  Top 0.61: R5.1 R6.1
N$40
  Top 0.61: T1.2 95.25,29.21 93.98,31.11 R5.2
N$41
  Top 0.61: R7.1 96.52,4.63 X1.16
N$42
  Top 0.813: R7.2 T1.3
N$43
  Top 0.406: S4.4 10.48,53.24 10.48,53.34 | 10.48,40.96 S4.3 | R8.1 33.02,31.75 IC8.1 | C1.1 19.05,33.02 17.78,33.02 | 17.78,40.64 17.68,40.74
  Top 0.61: 10.48,53.24 10.48,40.96 | 17.78,33.02 17.78,40.64 | 17.68,40.74 S4.3
  pour Top (isolate 0.813): 17.78,34.92 37.78,34.92 38.1,33.66 34.92,33.66 34.92,31.43 32.07,31.43 32.07,31.75 19.68,31.75 19.68,32.7 17.78,32.7
N$44
  Top 0.406: S2.4 10.48,35.46 | 10.48,23.18 S2.3 | 33.02,24.77 IC8.3 | 26.67,22.54 26.99,22.86 R9.1
  Top 0.61: 10.48,35.46 10.48,23.18 | R9.1 29.21,24.77 33.02,24.77 | S2.3 17.78,22.96 17.78,14.61 24.77,14.61 C2.1 26.67,16.51 26.67,22.54
  pour Top (isolate 0.813): 33.02,24.77 29.21,24.77 29.21,22.86 26.67,22.86 26.99,16.51 27.94,16.51 27.94,20.32 33.02,20.32
N$45
  Top 0.406: 12.38,3.81 12.28,3.91 S3.3 11.01,3.91 10.48,4.45 | S3.4 10.48,15.51
  Top 0.61: 11.43,16.41 S3.4 | R10.1 26.04,3.81 | IC8.5 27.94,20.32 27.94,10.79 26.04,10.79 26.04,3.81 | 12.38,3.81 19.05,3.81 | 19.05,3.81 26.04,3.81 | C3.1 19.05,3.81 | 10.48,15.51 10.48,4.45
N$46
  Top 0.813: IC4.VIN 71.75,76.83 C6.+ 79.45,78.18 S5.3 S5.4
N$47  (via drill 0.6 pad 1.78)
  other vias: 58.74,35.88
N$49  (via drill 0.6 pad 1.78)
  other vias: 56.2,35.88
N$50  (via drill 0.6 pad 1.78)
  other vias: 54.61,51.12
N$51  (via drill 0.6 pad 1.78)
  other vias: 98.74,64.14
N$52
  Top 0.61: 65.41,23.81 65.41,21.59
N$53  (via drill 0.6 pad 1.78)
  other vias: 70.48,15.56
N$54  (via drill 0.6 pad 1.78)
  other vias: 23.81,68.26
N$55
  Top 0.61: 63.5,24.13 63.5,21.59
N$56
  Top 0.813: IC1.2 62.23,48.26 JP4.1
N$57
  Top 0.813: IC1.3 59.69,47.62 57.47,49.85 JP4.2
N$58
  Top 0.406: U1.11 U1.4
N@16
  pour Top (isolate 0.813): 21.59,45.09 27.94,45.09 27.94,41.27 35.88,41.27 35.88,37.47 21.59,37.47
VSS  (via drill 0.6, 0.6 pad 1.78)
  Top 0.406: IC6.3 80.64,17.14 80.64,26.04 IC6.8 | X1.1 59.05,4.5 59.05,5.71 64.45,13.02 G1.2 64.45,33.97 72.39,41.91 77.47,41.91 R4.1 | S1.3 67.26,53.39 64.77,55.88 JP2.3 74.93,55.88 74.93,57.15 79.64,57.15 79.64,66.35 | C5.2 33.02,59.69 26.67,59.69 26.67,55.88 24.13,55.88 | 24.13,55.88 ISP1.6 | S2.1 8.89,22.96 8.89,38.1 15.88,38.1 15.88,26.67 C1.2 20.32,16.51 C2.2 | 30.48,15.24 30.48,1.59 | C3.2 24.13,10.16 | 15.88,10.16 15.88,18.41 1.91,18.41 | 70.17,69.85 70.17,70.17 | 10.79,55.56 10.79,60.01 9.53,61.28 U1.7 | 10.79,55.56 8.72,55.56 S4.2 | 23.5,59.69 23.5,58.74 | 23.5,58.74 23.5,56.52 24.13,55.88 | U1.10 14.61,55.56 10.79,55.56 | U1.1 24.77,63.5 23.5,63.5 | U1.12 U1.13 22.23,58.74 23.5,58.74
  Top 0.61: IC6.3 IC6.2 IC6.1 | IC6.8 85.09,27.94 86.36,29.21 86.36,36.83 R4.1 | IC8.7 30.48,15.24 | 24.13,10.16 15.88,10.16 | LED1.K 70.17,69.85 | 46.04,78.42 IC5.GND
  Top 0.813: LED3.K 90.81,74.29 J1.GND@2 90.81,73.61 LED3.K | LED3.K 78.11,69.85 C6.- | C6.- 76.2,72.39 72.39,72.39 | 72.39,72.39 79.64,66.35 IC7.1 IC7.2 | IC7.4 IC7.3 IC7.2 | IC7.2 IC7.7 | 72.39,72.39 69.22,72.39 IC4.GND 68.58,78.42 55.24,78.42 | 31.43,78.42 3.81,78.42 U$2.1 1.91,71.75 1.91,53.34 2.01,53.24 | 55.24,78.42 46.04,78.42 37.15,78.42 | IC5.GND 46.04,70.48 | 46.04,70.48 33.02,70.48 C4.2 C5.2 38.1,59.05 JP3.3 | S4.2 2.01,53.24 | 1.91,40.64 2.01,40.74 S4.1 | 1.91,40.64 1.91,53.14 2.01,53.24 | S2.2 2.01,35.46 | 2.01,35.46 1.91,35.56 1.91,40.64 | S2.1 2.01,22.96 1.91,22.86 | 1.91,22.86 1.91,35.36 2.01,35.46 | S3.2 2.01,16.41 1.91,16.51 | 1.91,16.51 1.91,18.41 1.91,22.86 | S3.1 6.4,2.27 6.35,1.91 | 6.35,1.91 30.48,1.91 30.48,1.59 48.26,1.59 | IC2.4 48.26,1.59 | 1.91,16.51 1.91,1.91 6.35,1.91 | 46.04,70.48 48.26,70.48 48.26,61.59 46.35,59.69 46.35,55.88 46.99,55.24 IC1.8 46.99,43.18 49.53,43.18 IC1.22 | S1.4 67.26,67.26 70.17,70.17 72.39,72.39 | X1.1 58.74,4.19 58.74,1.59 48.26,1.59 | JP1.3 v52.7,34.92 v53.02,34.92 | v71.12,31.75 76.2,36.83 R4.1 | C6.- | C7.- 55.24,78.42 | LED2.K 31.43,78.42 | 31.43,78.42 37.15,78.42 | C8.- 37.15,78.42 | 23.5,63.5 23.5,59.69
  Bottom 0.406: v53.02,34.92 56.2,31.75 v71.12,31.75
  pour Top (isolate 0.813): 73.03,75.88 72.07,75.88 71.75,76.2 71.75,77.47 71.44,77.79 58.1,77.79 58.1,74.61 55.24,74.61 52.39,77.79 35.88,77.79 35.88,75.25 29.84,75.25 29.53,77.47 5.08,77.47 5.08,71.75 4.76,71.44 16.19,71.44 16.19,71.12 12.06,66.99 13.02,57.78 17.14,57.78 11.11,56.2 10.79,40.64 19.05,40.96 19.05,40.64 17.78,40.64 18.1,37.15 18.1,31.75 20,30.8 20.32,14.61 27.94,14.61 27.94,19.05 35.24,19.05 34.29,8.89 61.59,3.49 61.91,3.81 61.91,0.32 62.23,0 0.32,0 0,0.32 0,80.01 73.03,80.01
  pour Top (isolate 0.813): 72.71,76.52 96.52,76.52 96.52,70.8 100.01,70.8 100.01,64.14 98.42,64.14 98.42,59.37 94.93,59.37 94.93,54.29 91.44,54.29 90.17,53.02 90.17,50.8 89.22,49.85 72.07,49.85 72.07,49.53 63.18,40.64 62.87,40.64 61.28,39.05 61.28,21.27 60.96,20.95 55.88,20.95 46.35,11.43 46.35,9.21 60.96,9.21 61.59,8.57 61.59,7.62 58.42,4.45 48.26,4.45 44.45,8.26 34.29,8.26 33.97,8.57 33.97,11.11 34.29,11.43 41.59,11.43 41.59,13.34 42.55,14.29 42.55,29.84 43.18,30.48 45.09,30.48 45.09,36.83 45.4,37.15 53.98,37.15 58.74,41.91 58.74,43.5 54.93,47.31 50.8,47.31 49.85,47.31 49.53,46.99 49.53,51.44 50.8,52.7 50.8,75.88 51.12,76.2 70.8,76.2
  pour Top (isolate 0.813): 64.77,50.8 68.26,50.8 69.22,51.75 99.38,51.75 100.33,50.8 100.33,0.32 42.86,0.32 42.55,0 42.55,29.21 63.18,49.85
  pour Top (isolate 0.813): 38.73,75.25 50.8,75.25 51.12,75.56 51.12,52.39 49.85,51.12 49.85,47.62 51.12,46.35 51.12,38.73 51.44,38.42 44.13,38.42 44.13,43.18 45.72,43.18 45.72,45.4 30.16,47.94 33.02,50.8 33.02,55.56 32.7,55.88 27.94,55.88 27.62,56.2 26.99,56.2 23.81,59.37 23.81,74.3 23.5,74.61 26.35,74.61 35.56,74.3 37.78,74.3
  pour Top (isolate 0.813): 18.73,16.51 26.67,16.51 26.67,22.86 29.53,22.86 29.53,24.77 33.02,24.77 33.02,30.48 17.78,30.48 17.78,24.13 18.73,24.13
  pour Top (isolate 0.813): 25.72,59.69 25.72,57.78 23.5,57.78 18.41,54.61 18.41,64.45 24.77,64.45